# EAGLE schematic Scarab (EAGLE 7.0.0)
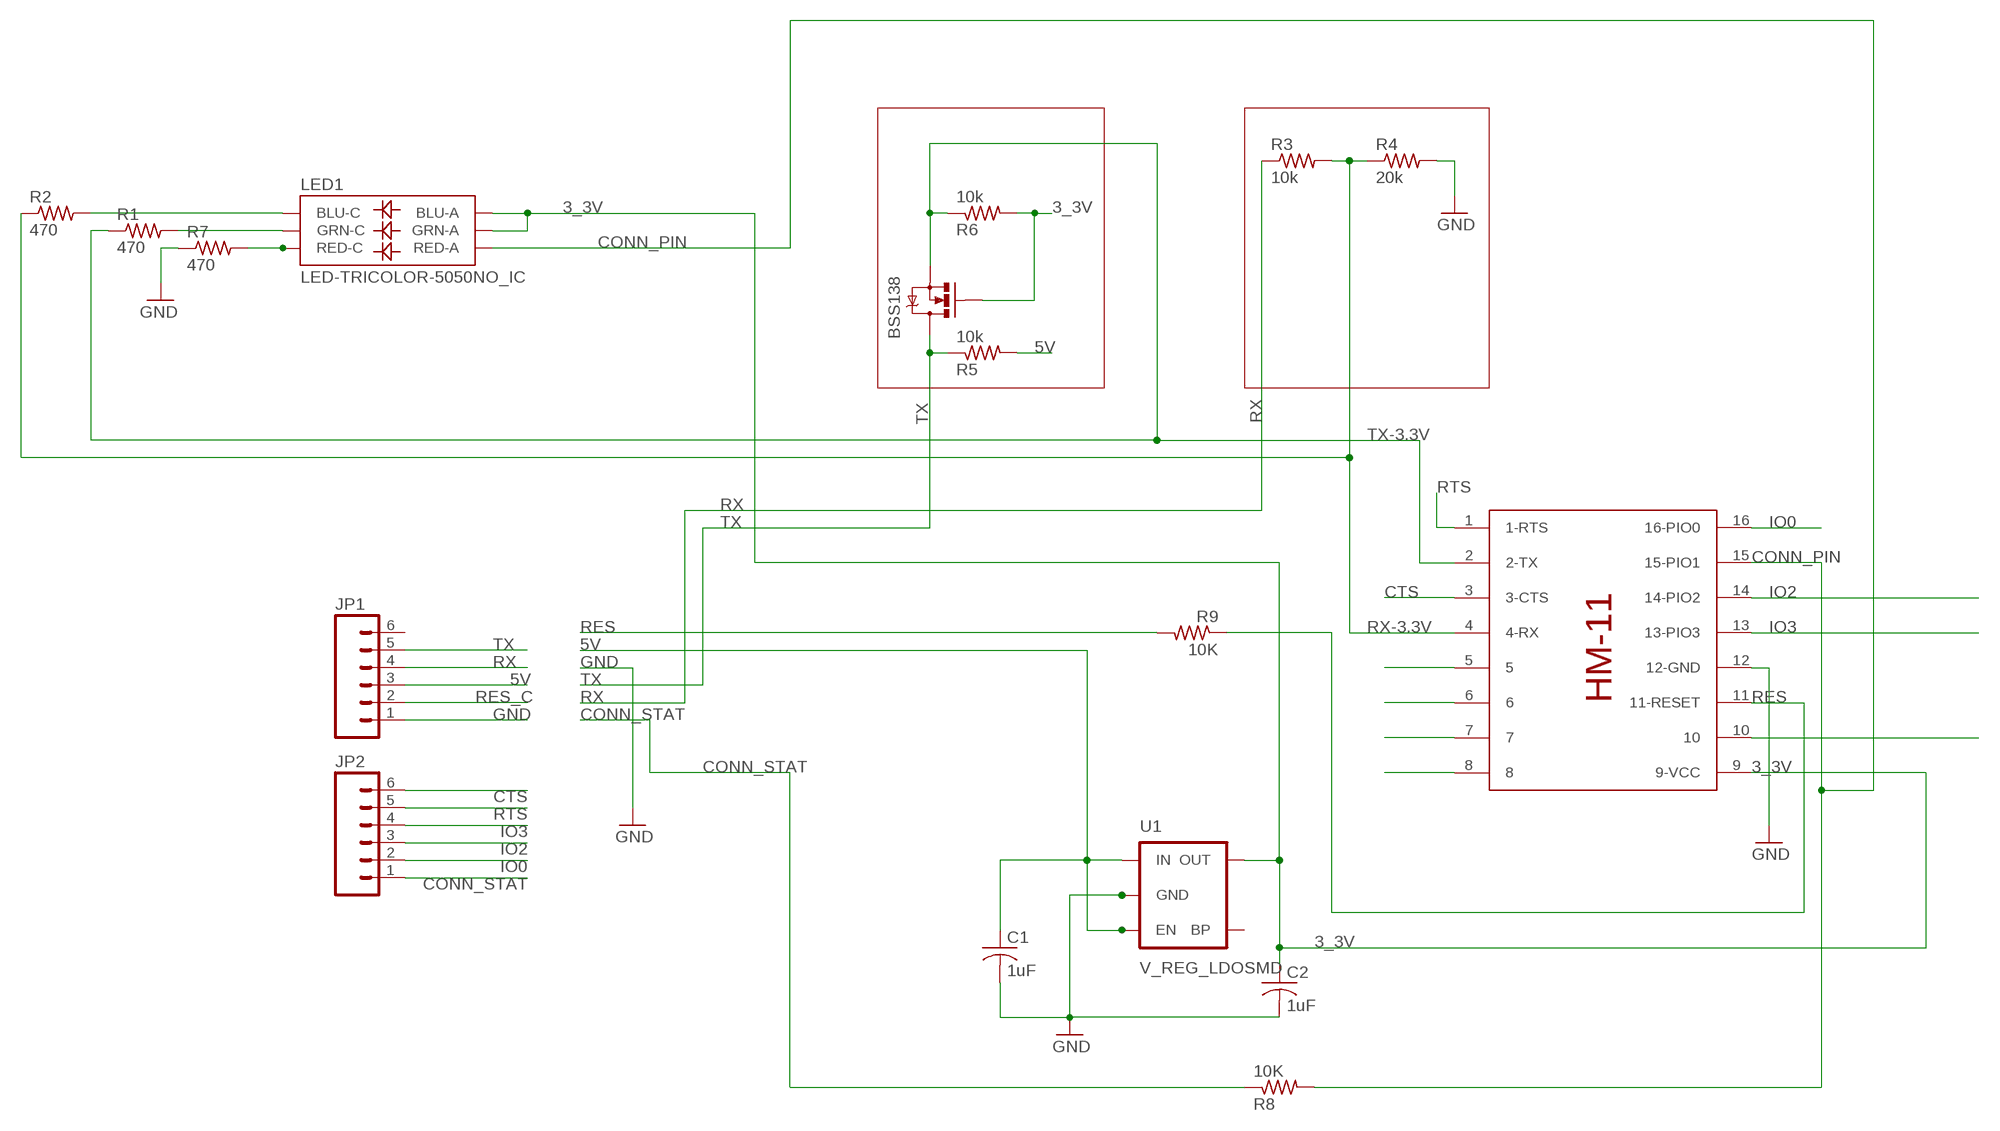
[diagram p0: schematic, sheet 1]

## Parts
BSS138  MOSFET-NCHANNELSMD  [SOT23-3]
C1  1uF  C-USC0402  [C0402]
C2  1uF  C-USC0402  [C0402]
JP1  M06LOCK  [1X06_LOCK]
JP2  M06LOCK  [1X06_LOCK]
LED1  LED-TRICOLOR-5050NO_IC  [LED-TRICOLOR-5050]
R1  470  R-US_R0402  [R0402]
R2  470  R-US_R0402  [R0402]
R3  10k  R-US_R0402  [R0402]
R4  20k  R-US_R0402  [R0402]
R5  10k  R-US_R0402  [R0402]
R6  10k  R-US_R0402  [R0402]
R7  470  R-US_R0402  [R0402]
R8  10K  R-US_R0402  [R0402]
R9  10K  R-US_R0402  [R0402]
U1  V_REG_LDOSMD  [SOT23-5]
U$1  HM-11  [HM-11]

## Nets
3_3V: BSS138.1(G) C2.1 LED1.1(GRN-A) LED1.3(BLU-A) R6.2 U1.5(OUT) U$1.9(9-VCC)
5V: C1.1 JP1.3 R5.2 U1.1(IN) U1.3(EN)
CONN_PIN: LED1.2(RED-A) R8.2 U$1.15(15-PIO1)
CONN_STAT: JP2.1 R8.1
CTS: JP2.6 U$1.3(3-CTS)
GND: C1.2 C2.2 JP1.1 R4.2 R7.1 U1.2(GND) U$1.12(12-GND)
IO0: JP2.2 U$1.16(16-PIO0)
IO2: JP2.3 U$1.14(14-PIO2)
IO3: JP2.4 U$1.13(13-PIO3)
N$2: LED1.6(GRN-C) R1.2
N$3: LED1.4(BLU-C) R2.2
N$4: U$1.10
N$10: U$1.5
N$11: U$1.6
N$14: U$1.7
N$15: U$1.8
N$26: LED1.5(RED-C) R7.2
RES: R9.1 U$1.11(11-RESET)
RES_C: JP1.2 R9.2
RTS: JP2.5 U$1.1(1-RTS)
RX: JP1.4 R3.1
RX-3.3V: R2.1 R3.2 R4.1 U$1.4(4-RX)
TX: BSS138.3(D) JP1.5 R5.1
TX-3.3V: BSS138.2(S) R1.1 R6.1 U$1.2(2-TX)
Unconnected: JP1.6 U1.4(BP)

## Library data of the parts
BSS138 = SparkFun:MOSFET-NCHANNEL
C1 C2 = resistor:C-US: CAPACITOR, American symbol
JP1 JP2 = SparkFun-Connectors:M06: Header 6 Standard 6-pin 0.1" header. Use with straight break away headers (SKU : PRT-00116), right angle break away headers (PRT-00553), swiss pins (PRT-00743), machine pins (PRT-00117), and female headers (PRT-00115). Molex polarized connector foot print use with SKU : PRT-08094 with associated crimp pins and housings. NOTES ON THE VARIANTS LOCK and LOCK_LONGPADS... This footprint was designed to help hold the alignment of a through-hole component (i.e. 6-pin header) while soldering it into place. You may notice that each hole has been shifted either up or down by 0.005 of an inch from it's more standard position (which is a perfectly straight line). This slight alteration caused the pins (the squares in the middle) to touch the edges of the holes. Because they are alternating, it causes a "brace" to hold the component in place. 0.005 has proven to be the perfect amount of "off-center" position when using our standard breakaway headers. Although looks a little odd when you look at the bare footprint, once you have a header in there, the alteration is very hard to notice. Also,if you push a header all the way into place, it is covered up entirely on the bottom side. This idea of altering the position of holes to aid alignment will be further integrated into the Sparkfun Library for other footprints. It can help hold any component with 3 or more connection pins.
LED1 = SparkFun-LED:LED-TRICOLOR-5050
R1-R9 = resistor:R-US_: RESISTOR, American symbol
U1 = SparkFun:V_REG_LDO: Voltage Regulator LDO Standard 150mA LDO voltage regulator in SOT-23 layout. Micrel part MIC5205. BP (by-pass) pin is used to lower output noise with 470pF cap.
U$1 = HM-11:HM-11